# EAGLE design v3 (EAGLE 5.11)
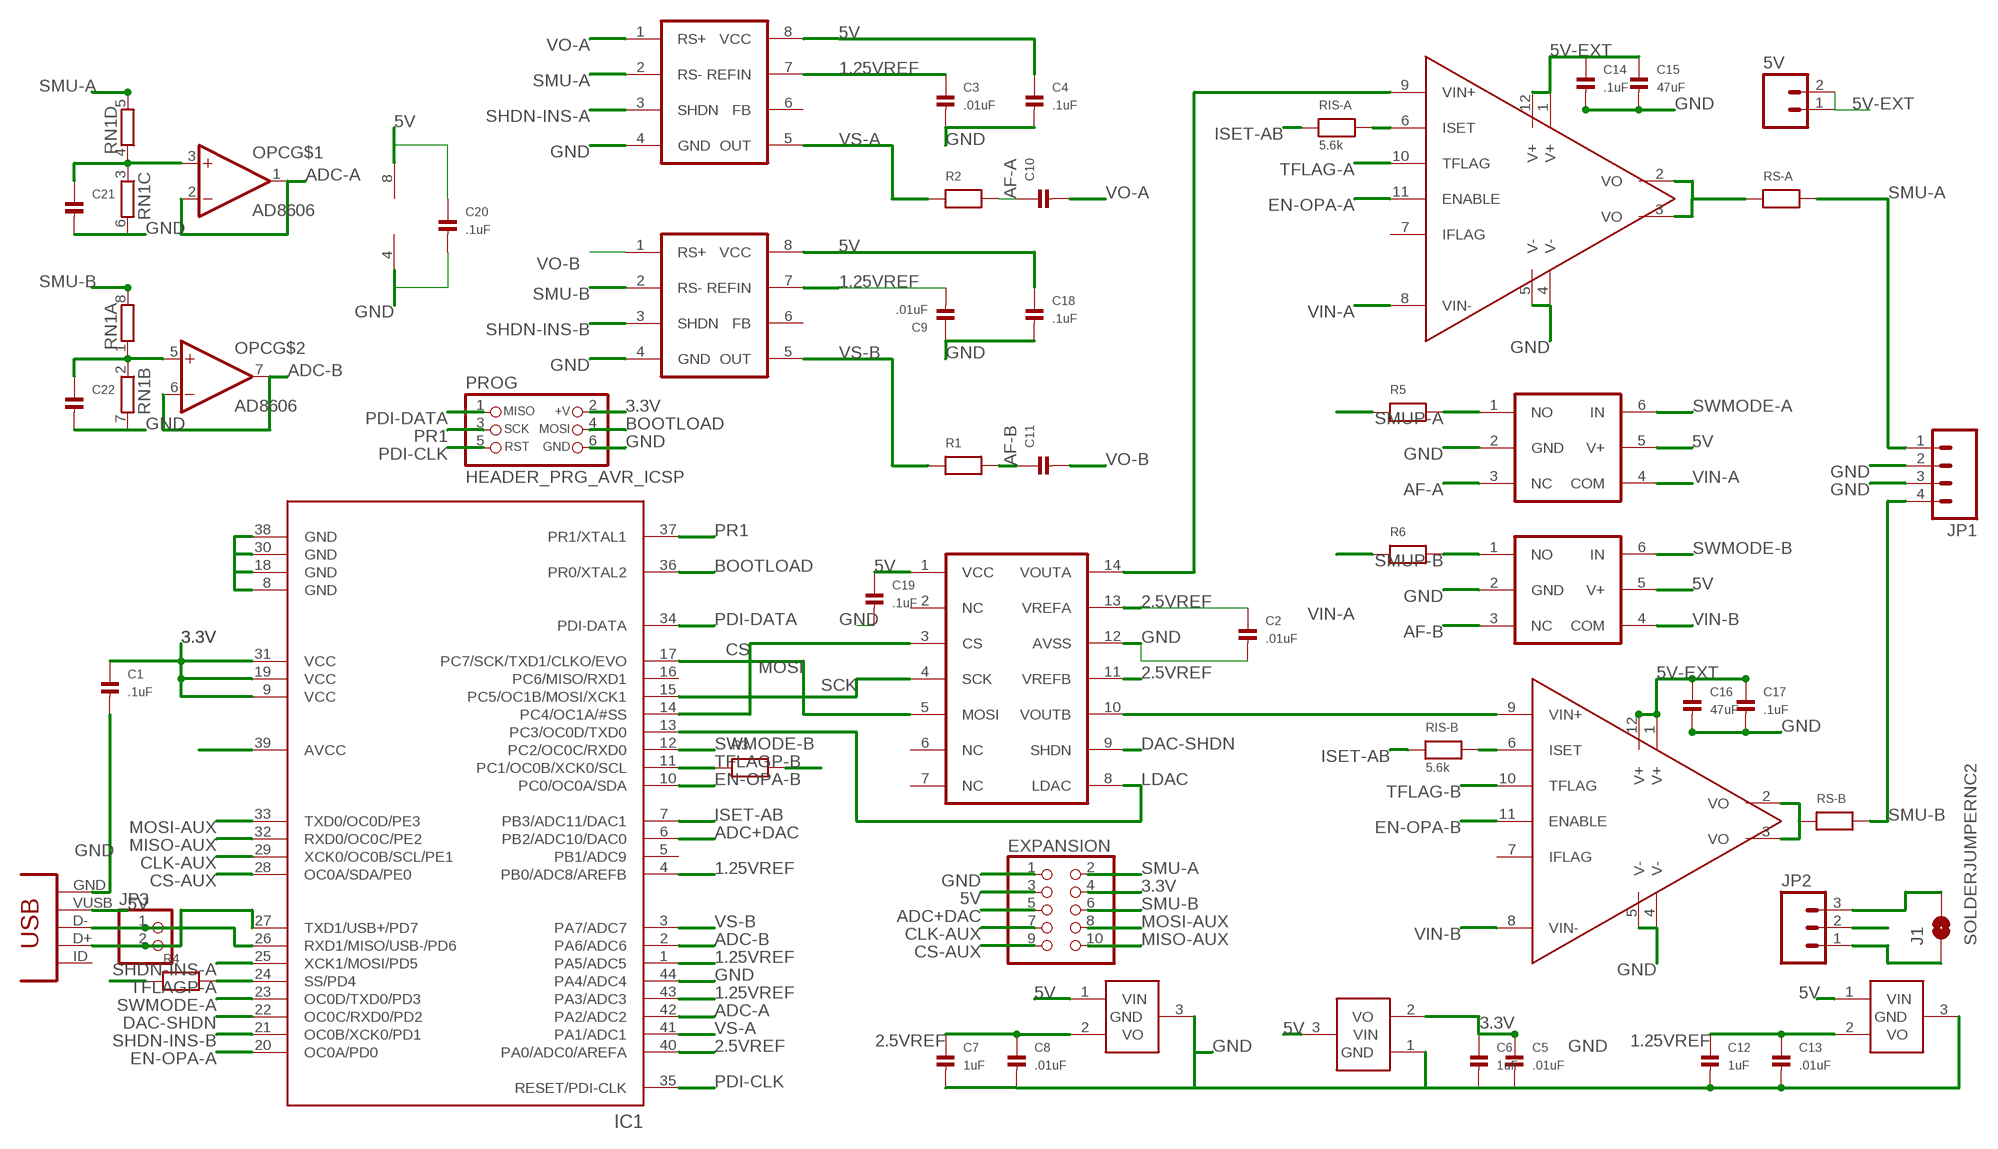
[diagram p0: schematic, sheet 1]

## Parts
1.25REF  VREFVREF  [SOT23-3]
2.5REF  VREFVREF  [SOT23-3]
3.3V  VREG  [SOT23-3]
5V  M02PTH  [1X02]
C1  .1uF  CAP_CERAMIC0603  [0603]
C2  .01uF  CAP_CERAMIC0603  [0603]
C3  .01uF  CAP_CERAMIC0603  [0603]
C4  .1uF  CAP_CERAMIC0603  [0603]
C5  .01uF  CAP_CERAMIC0603  [0603]
C6  1uF  CAP_CERAMIC0603  [0603]
C7  1uF  CAP_CERAMIC0603  [0603]
C8  .01uF  CAP_CERAMIC0603  [0603]
C9  .01uF  CAP_CERAMIC0603  [0603]
C10  CAP_CERAMIC0603  [0603]
C11  CAP_CERAMIC0603  [0603]
C12  1uF  CAP_CERAMIC0603  [0603]
C13  .01uF  CAP_CERAMIC0603  [0603]
C14  .1uF  CAP_CERAMIC0603  [0603]
C15  47uF  CAP_CERAMIC1206  [1206]
C16  47uF  CAP_CERAMIC1206  [1206]
C17  .1uF  CAP_CERAMIC0603  [0603]
C18  .1uF  CAP_CERAMIC0603  [0603]
C19  .1uF  CAP_CERAMIC0603  [0603]
C20  .1uF  CAP_CERAMIC0603  [0603]
C21  CAP_CERAMIC0603  [0603]
C22  CAP_CERAMIC0603  [0603]
CS-A  MAX9919  [SO-08]
CS-B  MAX9919  [SO-08]
DAC  MCP4922  MCP4922SOIC  [SO-14]
EXPANSION  HEADER-2X5  [2X05]
IC1  ATXMEGAXXA4U  [TQFP-44]
J1  SOLDERJUMPERNC2  [SJ_2S-NOTRACE]
JP1  M04PTH  [1X04]
JP2  M03PTH  [1X03]
JP3  HEADER-1X2ROUND  [1X02_ROUND]
OPA-A  OPA567  [QFN-12]
OPA-B  OPA567  [QFN-12]
OPC  AD8606  [SO-08]
PROG  HEADER_PRG_AVR_ICSP  [HEADER_PRG_2X03]
R1  RESISTOR0603  [0603]
R2  RESISTOR0603  [0603]
R3  RESISTOR0603  [0603]
R4  RESISTOR0603  [0603]
R5  RESISTOR0603  [0603]
R6  RESISTOR0603  [0603]
RIS-A  5.6k  RESISTOR0603  [0603]
RIS-B  5.6k  RESISTOR0603  [0603]
RN1  RNETWORK  [RN8P-4R-CRA06S]
RS-A  RESISTOR1206  [1206]
RS-B  RESISTOR1206  [1206]
SWA  TS5A3157  [SOT23-6]
SWB  TS5A3157  [SOT23-6]
USB1  USB-MINI-BUSB1  [CONN_USB_MINI-B]

## Nets
1.25VREF: 1.25REF.2(VO) C3.1 C9.2 C12.1 C13.1 CS-A.7(REFIN) CS-B.7(REFIN) IC1.1(PA5/ADC5) IC1.4(PB0/ADC8/AREFB) IC1.43(PA3/ADC3)
2.5VREF: 2.5REF.2(VO) C2.1 C7.1 C8.1 DAC.11(VREFB) DAC.13(VREFA) IC1.40(PA0/ADC0/AREFA)
3.3V: 3.3V.2(VO) C1.1 C5.1 C6.1 EXPANSION.4 IC1.9(VCC) IC1.19(VCC) IC1.31(VCC) IC1.39(AVCC) PROG.2(+V)
5V: 1.25REF.1(VIN) 2.5REF.1(VIN) 3.3V.3(VIN) C4.1 C18.1 C19.1 C20.1 CS-A.8(VCC) CS-B.8(VCC) DAC.1(VCC) EXPANSION.3 J1.1 JP2.1 OPC.8(V+) SWA.5(V+) SWB.5(V+) USB1.VUSB
5V-EXT: 5V.1 5V.2 C14.1 C15.1 C16.1 C17.1 J1.2 JP2.3 OPA-A.1(V+) OPA-A.12(V+) OPA-B.1(V+) OPA-B.12(V+)
ADC+DAC: EXPANSION.5 IC1.6(PB2/ADC10/DAC0)
ADC-A: IC1.42(PA2/ADC2) OPC.1(OUT) OPC.2(-IN)
ADC-B: IC1.2(PA6/ADC6) OPC.6(-IN) OPC.7(OUT)
AF-A: C10.1 R2.2 SWA.3(NC)
AF-B: C11.1 R1.2 SWB.3(NC)
BOOTLOAD: IC1.36(PR0/XTAL2) PROG.4(MOSI)
CLK-AUX: EXPANSION.7 IC1.29(XCK0/OC0B/SCL/PE1)
CS: DAC.3(CS) IC1.14(PC4/OC1A/#SS)
CS-AUX: EXPANSION.9 IC1.28(OC0A/SDA/PE0)
D+: IC1.27(TXD1/USB+/PD7) JP3.2 USB1.D+
D-: IC1.26(RXD1/MISO/USB-/PD6) JP3.1 USB1.D-
DAC-SHDN: DAC.9(SHDN) IC1.22(OC0C/RXD0/PD2)
EN-OPA-A: IC1.20(OC0A/PD0) OPA-A.11(ENABLE)
EN-OPA-B: IC1.10(PC0/OC0A/SDA) OPA-B.11(ENABLE)
GND: 1.25REF.3(GND) 2.5REF.3(GND) 3.3V.1(GND) C1.2 C2.2 C3.2 C4.2 C5.2 C6.2 C7.2 C8.2 C9.1 C12.2 C13.2 C14.2 C15.2 C16.2 C17.2 C18.2 C19.2 C20.2 C21.2 C22.2 CS-A.4(GND) CS-B.4(GND) DAC.12(AVSS) EXPANSION.1 IC1.8(GND) IC1.18(GND) IC1.30(GND) IC1.38(GND) IC1.44(PA4/ADC4) JP1.2 JP1.3 JP2.2 OPA-A.4(V-) OPA-A.5(V-) OPA-B.4(V-) OPA-B.5(V-) OPC.4(V-) PROG.6(GND) RN1.6 RN1.7 SWA.2(GND) SWB.2(GND) USB1.GND
IC2A-: C21.1 OPC.3(+IN) RN1.3 RN1.4
IC2B-: C22.1 OPC.5(+IN) RN1.1 RN1.2
ISET-A: OPA-A.6(ISET) RIS-A.2
ISET-AB: IC1.7(PB3/ADC11/DAC1) RIS-A.1 RIS-B.1
ISET-B: OPA-B.6(ISET) RIS-B.2
LDAC: DAC.8(LDAC) IC1.13(PC3/OC0D/TXD0)
MISO-AUX: EXPANSION.10 IC1.32(RXD0/OC0C/PE2)
MOSI: DAC.5(MOSI) IC1.17(PC7/SCK/TXD1/CLKO/EVO)
MOSI-AUX: EXPANSION.8 IC1.33(TXD0/OC0D/PE3)
PDI-CLK: IC1.35(RESET/PDI-CLK) PROG.5(RST)
PDI-DATA: IC1.34(PDI-DATA) PROG.1(MISO)
PR1: IC1.37(PR1/XTAL1) PROG.3(SCK)
SCK: DAC.4(SCK) IC1.15(PC5/OC1B/MOSI/XCK1)
SHDN-INS-A: CS-A.3(SHDN) IC1.25(XCK1/MOSI/PD5)
SHDN-INS-B: CS-B.3(SHDN) IC1.21(OC0B/XCK0/PD1)
SMU-A: CS-A.2(RS-) EXPANSION.2 JP1.1 R5.1 RN1.5 RS-A.2
SMU-B: CS-B.2(RS-) EXPANSION.6 JP1.4 R6.1 RN1.8 RS-B.2
SMUP-A: R5.2 SWA.1(NO)
SMUP-B: R6.2 SWB.1(NO)
SWMODE-A: IC1.23(OC0D/TXD0/PD3) SWA.6(IN)
SWMODE-B: IC1.12(PC2/OC0C/RXD0) SWB.6(IN)
TFLAG-A: OPA-A.10(TFLAG) R4.1
TFLAG-B: OPA-B.10(TFLAG) R3.2
TFLAGP-A: IC1.24(SS/PD4) R4.2
TFLAGP-B: IC1.11(PC1/OC0B/XCK0/SCL) R3.1
VIN-A: OPA-A.8(VIN-) SWA.4(COM)
VIN-B: OPA-B.8(VIN-) SWB.4(COM)
VO-A: C10.2 CS-A.1(RS+) OPA-A.2(VO) OPA-A.3(VO) RS-A.1
VO-B: C11.2 CS-B.1(RS+) OPA-B.2(VO) OPA-B.3(VO) RS-B.1
VOUT-A: DAC.14(VOUTA) OPA-A.9(VIN+)
VOUT-B: DAC.10(VOUTB) OPA-B.9(VIN+)
VS-A: CS-A.5(OUT) IC1.41(PA1/ADC1) R2.1
VS-B: CS-B.5(OUT) IC1.3(PA7/ADC7) R1.1
Unconnected: CS-A.6(FB) CS-B.6(FB) DAC.2(NC) DAC.6(NC) DAC.7(NC) IC1.5(PB1/ADC9) IC1.16(PC6/MISO/RXD1) OPA-A.7(IFLAG) OPA-B.7(IFLAG) USB1.BODY@1(BODY) USB1.BODY@2(BODY) USB1.BODY@3(BODY) USB1.BODY@4(BODY) USB1.ID(USBID)

## Library data of the parts
1.25REF 2.5REF = nonolith:VREF
3.3V = nonolith:VREG
5V = SparkFun:M02: Header 2 Standard 2-pin 0.1" header. Use with straight break away headers (SKU : PRT-00116), right angle break away headers (PRT-00553), swiss pins (PRT-00743), machine pins (PRT-00117), and female headers (PRT-00115). Molex polarized connector foot print use with SKU : PRT-08233 with associated crimp pins and housings.
C1-C22 = nonolith:CAP_CERAMIC: Ceramic Capacitors 0402 - 0402 Surface Mount Capacitors 0.1uF 10V 10% [Digikey: 490-1318-2-ND] 0603 - 0603 Surface Mount Capacitors 16 pF 50V 5% [Digikey: 445-5051-2-ND] 22 pF 50V [Digikey: PCC220ACVTR-ND] 33 pF 50V 5% [Digikey: 490-1415-1-ND] 56pF 50V 5% [Digikey: 490-1421-1-ND] 220pF 50V 5% [Digikey: 445-1285-1-ND] 680 pF 50V 2200 pF 50V 5% C0G [Digikey: 445-1297-1-ND] 5600 pF 100V 5% X7R [Digikey: 478-3711-1-ND] 0.1 µF 25V 10% [Digikey: PCC2277TR-ND] 0.22 µF 16V 10% X7R [Digikey: 445-1318-1-ND] 1.0 µF 25V 10% [Digikey: 445-5146-2-ND] 0603 - RF Specific 3pF 250V +/-0.1pF RF [Digikey: 712-1347-1-ND] 18 pF 250V 5% [Digikey: 478-3505-1-ND or 712-1322-1-ND] 56 pF 250V 5% C0G RF [Digikey: 490-4867-1-ND] 68 pF 250V RF [Digikey: 490-4868-1-ND] 0805 - 0805 Surface Mount Capacitors 220 pF 250V 2% RF Ceramic Capacitor [Digikey: 712-1398-1-ND] 1000 pF 50V 2% NP0 Ceramic Capacitor [Digikey: 478-3760-1-ND] 0.1 µF 25V 10% Ceramic Capacitor [Digikey: PCC1828TR-ND] 1.0 µF 16V 10% Ceramic Capacitor[Digikey: 490-1691-2-ND] 10.0 µF 10V 10% Ceramic Capacitor[Digikey: 709-1228-1-ND] 1206 - 1206 Surface Mount Capacitors
CS-A CS-B = nonolith:MAX9919: MAX9919 single-channel current sense amp with high common mode voltage range and high bandwidth
DAC = nonolith:MCP4922: MCP4922 12b SPI DAC
EXPANSION = nonolith:HEADER-2X5: PIN HEADER
IC1 = nonolith:ATXMEGAXXA4U: ATXMEGA A4U Series (XMEGA+USB)
J1 = SparkFun:SOLDERJUMPER: Solder Jumper Standard SMD solder jumper. Used to automate production. Two varients : Normally Open and Normally Closed are the same, but have different paste layers. NC will have a large amount of paste and should jumper during reflow.
JP1 = SparkFun:M04: Header 4 Standard 4-pin 0.1" header. Use with straight break away headers (SKU : PRT-00116), right angle break away headers (PRT-00553), swiss pins (PRT-00743), machine pins (PRT-00117), and female headers (PRT-00115). Molex polarized connector foot print use with SKU : PRT-08231 with associated crimp pins and housings. 1MM SMD Version SKU: PRT-10208
JP2 = SparkFun:M03: Header 3 Standard 3-pin 0.1" header. Use with straight break away headers (SKU : PRT-00116), right angle break away headers (PRT-00553), swiss pins (PRT-00743), machine pins (PRT-00117), and female headers (PRT-00115). Molex polarized connector foot print use with SKU : PRT-08232 with associated crimp pins and housings.
JP3 = nonolith:HEADER-1X2: PIN HEADER
OPA-A OPA-B = nonolith:OPA567: OPA567: 2a RRIO CMOS OPA / QFN12
OPC = nonolith:AD8606
PROG = dp_devices:HEADER_PRG_AVR_ICSP: 2x3 AVR ICSP programming header
R1-R6 RIS-A RIS-B RS-A RS-B = nonolith:RESISTOR: Resistors 0402 - 0402 Surface Mount Package 10.0K 1% 1/16W [Digikey: 311-10.0KLRTR-ND] 0603 - 0603 Surface Mount Package 0 Ohm 1/10 Watt 1% Resistor 15 Ohm 1/10 Watt 1% Resistor 33 Ohm 1/10 Watt 1% Resistor 49.9 Ohm 1/10 Watt 1% Resistor 100 Ohm 1/10 Watt 1% Resistor 150 Ohm 1/10 Watt 1% Resistor 240 Ohm 1/10 Watt 1% Resistor 390 Ohm 1/10 Watt 1% Resistor 560 Ohm 1/10 Watt 1% Resistor 750 Ohm 1/10 Watt 1% Resistor 1.0K Ohm 1/10 Watt 1% Resistor 1.5K Ohm 1/10 Watt 1% Resistor 2.0K Ohm 1/10 Watt 1% Resistor 4.7K Ohm 1/10 Watt 1% Resistor 10.0K Ohm 1/10 Watt 1% Resistor 20.0K Ohm 1/10 Watt 1% Resistor 33.0K Ohm 1/10 Watt 1% Resistor 100.0K Ohm 1/10 Watt 1% Resistor 0805 - 0805 Surface Mount Package 0 Ohm 1/8 Watt 1% Resistor 33 Ohm 1/8 Watt 1% Resistor 100 Ohm 1/8 Watt 1% Resistor 150 Ohm 1/8 Watt 1% Resistor 200 Ohm 1/8 Watt 1% Resistor 240 Ohm 1/8 Watt 1% Resistor 330 Ohm 1/8 Watt 1% Resistor 390 Ohm 1/8 Watt 1% Resistor 470 Ohm 1/8 Watt 1% Resistor 1.0K Ohm 1/8 Watt 1% Resistor 1.5K Ohm 1/8 Watt 1% Resistor 2.0K Ohm 1/8 Watt 1% Resistor 4.7K Ohm 1/8 Watt 1% Resistor 5.1K Ohm 1/8 Watt 1% Resistor 5.6K Ohm 1/8 Watt 1% Resistor 10.0K Ohm 1/8 Watt 1% Resistor 22.0K Ohm 1/8 Watt 1% Resistor 33.0K Ohm 1/8 Watt 1% Resistor 100K Ohm 1/8 Watt 1% Resistor 1206 - 1206 Surface Mount Package
RN1 = nonolith:RNETWORK: 4 Resistor Array 0603
SWA SWB = nonolith:TS5A3157: Single SPDT Switch in SOT23
USB1 = nonolith:USB-MINI-B: USB connector

## Net classes
0 default: width 0.254 mm, clearance 0.127 mm

## Board
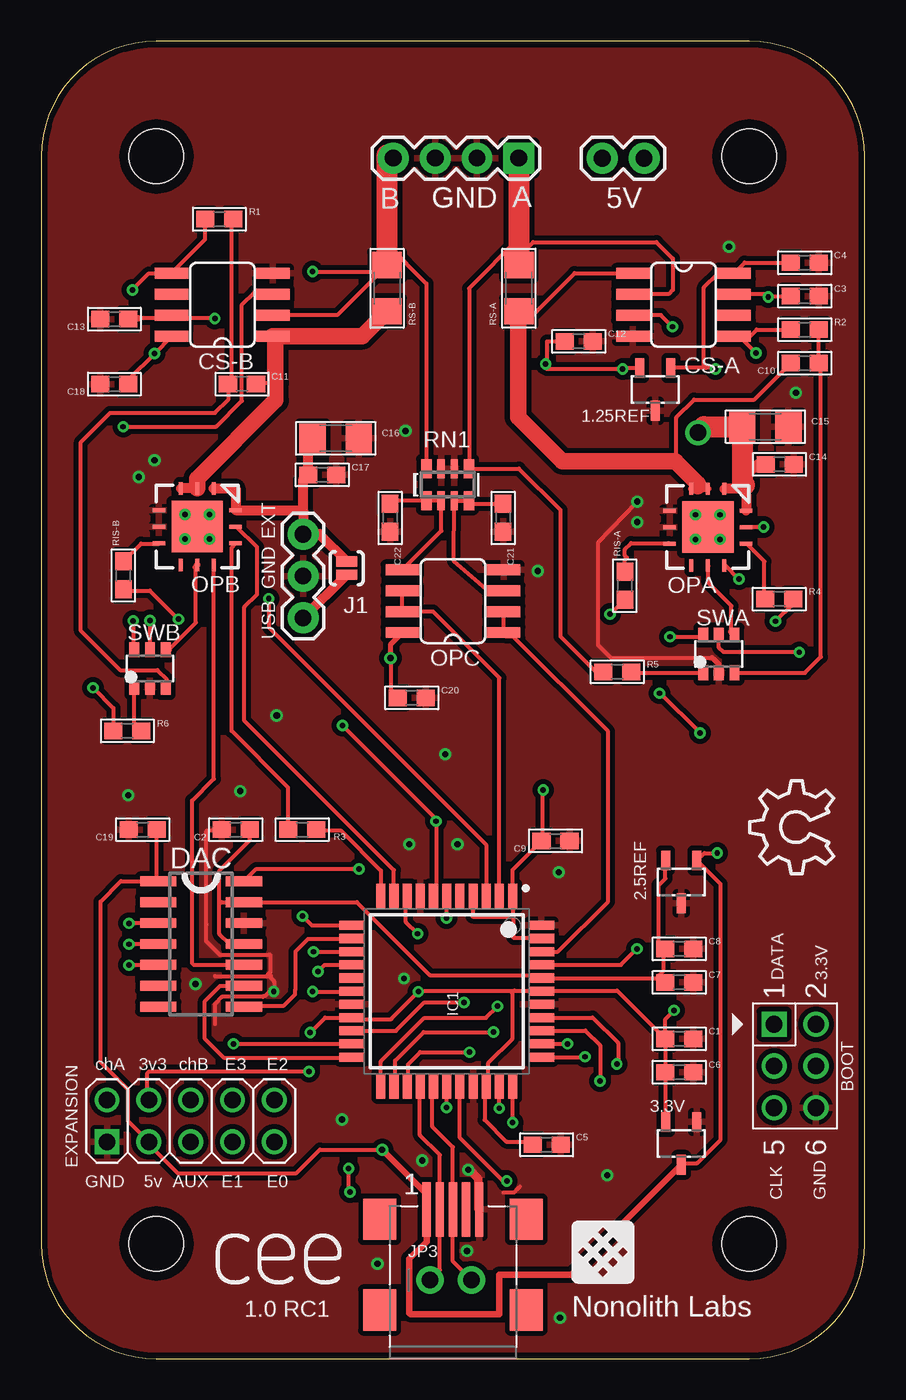
[diagram p1: board, top side]
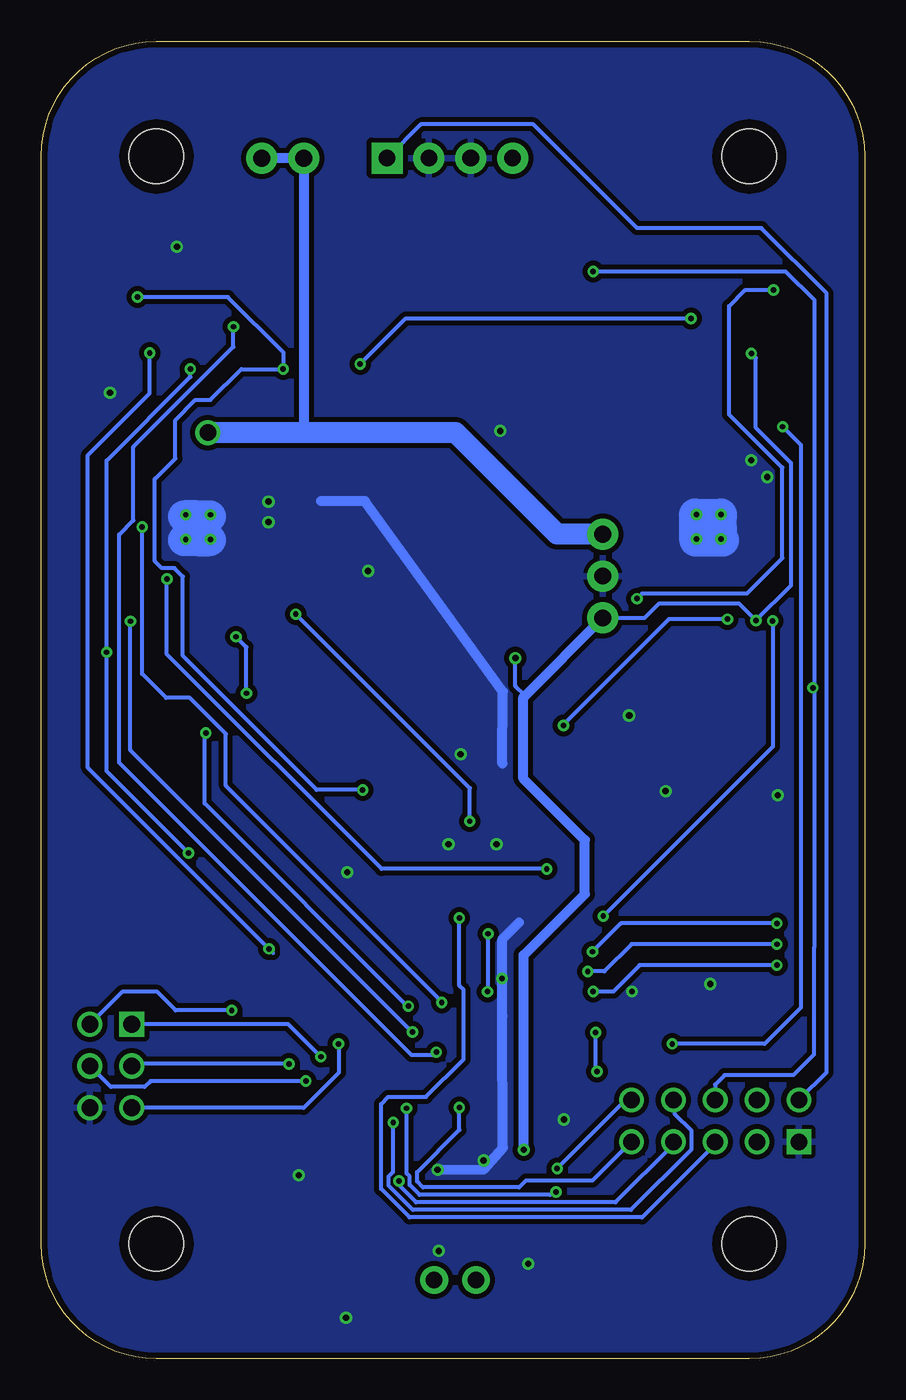
[diagram p2: board, bottom side, seen from below]

Size 50 x 80 mm. Coordinates in mm from the lower left corner, seen from the top.
Outline: 43,0 arc90 50,7 50,73 arc90 43,80 7,80 arc90 0,73 0,7 arc90 7,0 43,0
Copper layers (1*16): Top 0.0356mm / dielectric 1.5011mm / Bottom 0.0356mm
Design rules "LaenPCBOrder *": minimum track width 6mil, minimum drill 13mil, track to track 6mil, track to pad 6mil, pad to pad 6mil, via to via 6mil, smd to smd 6mil, copper to edge 15mil, drill to drill 6mil, minimum pad ring 7mil, minimum via ring 7mil, stop-mask expansion 4mil, vias tented up to drill 0mil, thermal gap 10mil

### Footprints (pad centres in the part's own frame; a part is rotated, then mirrored left to right if it is on the bottom)
SOT23-3 = smd 0.55 x 1.2: 1 0.95,1.3; 2 -0.95,1.3; 3 0,-1.3
1X02 = drill 1.016 pad 1.88 round: 1 0,0; 2 2.54,0
0603 = smd 1.1 x 1: 1 -0.85,0; 2 0.85,0
1206 = smd 1.6 x 1.8: 1 -1.4,0; 2 1.4,0
SO-08 = smd 0.66 x 2.032: 1 -1.905,-3.073; 2 -0.635,-3.073; 3 0.635,-3.073; 4 1.905,-3.073; 5 1.905,3.073; 6 0.635,3.073; 7 -0.635,3.073; 8 -1.905,3.073
SO-14 = smd 0.6 x 2.2: 1 -3.81,-2.6; 2 -2.54,-2.6; 3 -1.27,-2.6; 4 0,-2.6; 5 1.27,-2.6; 6 2.54,-2.6; 7 3.81,-2.6; 8 3.81,2.6; 9 2.54,2.6; 10 1.27,2.6; 11 0,2.6; 12 -1.27,2.6; 13 -2.54,2.6; 14 -3.81,2.6
2X05 = drill 1 square: 1 -5.08,-1.27 | drill 1 round: 2 -5.08,1.27; 3 -2.54,-1.27; 4 -2.54,1.27; 5 0,-1.27; 6 0,1.27; 7 2.54,-1.27; 8 2.54,1.27; 9 5.08,-1.27; 10 5.08,1.27
TQFP-44 = smd 1.55 x 0.55: 1 -5.75,4; 2 -5.75,3.2; 3 -5.75,2.4; 4 -5.75,1.6; 5 -5.75,0.8; 6 -5.75,0; 7 -5.75,-0.8; 8 -5.75,-1.6; 9 -5.75,-2.4; 10 -5.75,-3.2; 11 -5.75,-4; 23 5.75,-4; 24 5.75,-3.2; 25 5.75,-2.4; 26 5.75,-1.6; 27 5.75,-0.8; 28 5.75,0; 29 5.75,0.8; 30 5.75,1.6; 31 5.75,2.4; 32 5.75,3.2; 33 5.75,4 | smd 0.55 x 1.55: 12 -4,-5.75; 13 -3.2,-5.75; 14 -2.4,-5.75; 15 -1.6,-5.75; 16 -0.8,-5.75; 17 0,-5.75; 18 0.8,-5.75; 19 1.6,-5.75; 20 2.4,-5.75; 21 3.2,-5.75; 22 4,-5.75; 34 4,5.75; 35 3.2,5.75; 36 2.4,5.75; 37 1.6,5.75; 38 0.8,5.75; 39 0,5.75; 40 -0.8,5.75; 41 -1.6,5.75; 42 -2.4,5.75; 43 -3.2,5.75; 44 -4,5.75
SJ_2S-NOTRACE = smd 0.635 x 1.27: 1 -0.401,0; 2 0.413,0
1X04 = drill 1.016 pad 1.88 square: 1 0,0 | drill 1.016 pad 1.88 round: 2 2.54,0; 3 5.08,0; 4 7.62,0
1X03 = drill 1.016 pad 1.88 round: 1 0,0; 2 2.54,0; 3 5.08,0
1X02_ROUND = drill 1 pad 1.676 round: 1 -1.27,0; 2 1.27,0
QFN-12 = smd 0.75 x 0.24: 1 -2.365,0.96; 2 -2.365,-0.04; 3 -2.365,-1.04; 7 2.285,-1.04; 8 2.285,-0.04; 9 2.285,0.96 | smd 0.24 x 0.75: 4 -1.04,-2.365; 5 -0.04,-2.365; 6 0.96,-2.365; 10 0.96,2.285; 11 -0.04,2.285; 12 -1.04,2.285 | smd 3.12 x 3.12: P$1 -0.04,-0.04 | drill 0.33 round: P$2 -0.786,0.706; P$4 0.706,0.706; P$6 -0.786,-0.786; P$7 0.706,-0.786
HEADER_PRG_2X03 = drill 1.016 square: 1 -2.54,-1.27 | drill 1.016 round: 2 -2.54,1.27; 3 0,-1.27; 4 0,1.27; 5 2.54,-1.27; 6 2.54,1.27
RN8P-4R-CRA06S = smd 0.63 x 1.15: 1 -1.295,-0.975; 4 1.295,-0.975; 5 1.295,0.975; 8 -1.295,0.975 | smd 0.44 x 1.15: 2 -0.4,-0.975; 3 0.4,-0.975; 6 0.4,0.975; 7 -0.4,0.975
SOT23-6 = smd 0.6 x 0.9: 1 -0.95,-1.15; 2 0,-1.15; 3 0.95,-1.15; 4 0.95,1.15; 5 0,1.15; 6 -0.95,1.15
STAND-OFF = hole 3.302: 0,0
CONN_USB_MINI-B = smd 2 x 2.5: BODY@1 -4.45,2.5; BODY@2 4.45,2.5; BODY@3 4.45,-3; BODY@4 -4.45,-3 | smd 0.5 x 3.3: D+ 0,3.1; D- -0.8,3.1; GND 1.6,3.1; ID 0.8,3.1; VUSB -1.6,3.1

### Placement (x,y rotation side)
1.25REF  37.28,58.86 0 top
2.5REF  38.86,28.96 0 top
3.3V  38.86,13.08 0 top
5V  34.06,72.9 0 top
C1  38.73,19.43 0 top
C2  11.81,32.13 180 top
C3  46.35,64.52 0 top
C4  46.35,66.55 0 top
C5  30.69,13 0 top
C6  38.73,17.4 0 top
C7  38.73,22.86 0 top
C8  38.73,24.89 0 top
C9  31.23,31.44 180 top
C10  46.35,60.45 180 top
C11  12.19,59.18 0 top
C12  32.63,61.78 0 top
C13  4.45,63.12 180 top
C14  44.83,54.31 0 top
C15  43.97,56.59 0 top
C16  17.88,55.88 0 top
C17  17.07,53.67 0 top
C18  4.45,59.18 180 top
C19  6.17,32.13 180 top
C20  22.5,40.13 0 top
C21  28.04,51.05 270 top
C22  21.18,51.05 270 top
CS-A  39,64 270 top
CS-B  11,64 90 top
DAC  9.71,25.19 270 top
EXPANSION  9.08,14.45 0 top
IC1  24.62,22.32 270 top
J1  18.54,48.01 90 top
JP1  29,72.9 180 top
JP2  15.9,44.98 90 top
JP3  24.87,4.78 0 top
OPA-A  40.51,50.46 270 top
OPA-B  9.51,50.49 270 top
OPC  25,46 90 top
PROG  45.77,17.78 270 top
R1  10.82,69.19 0 top
R2  46.35,62.48 0 top
R3  15.85,32.13 180 top
R4  44.81,46.13 0 top
R5  34.98,41.71 0 top
R6  5.23,38.13 0 top
RIS-A  35.43,46.93 90 top
RIS-B  5,47.57 90 top
RN1  24.68,53.08 0 top
RS-A  29,65 90 top
RS-B  21,65 90 top
SWA  41.15,42.8 0 top
SWB  6.6,41.91 0 top
U$1  [OSHW_8X200_NOTEXT]  48.11,29.44 90 top
U$2  [LOGO_CEE]  10.49,4.11 0 top
U$3  [LOGO_NONOLITH]  32.21,4.57 0 top
U$8  [STAND-OFF]  7,7 0 top
U$9  [STAND-OFF]  43,7 0 top
U$10  [STAND-OFF]  43,73 0 top
U$11  [STAND-OFF]  7,73 0 top
USB1  25,5.97 0 top

### Tracks (layer width: path | path; a pad name or v marks a point on that pad's centre or on a via)
1.25VREF  (via drill 0.33)
  Top 0.254: CS-A.7 43.98,64.64 v44.15,64.47 44.19,64.52 C3.1 | C9.2 | 28.65,26.85 28.65,28.07 IC1.1 28.62,29.68 C9.2 | 26.22,26.85 28.65,26.85 | 26.22,26.85 26.19,26.85 | 26.22,26.85 IC1.4 | 28.65,26.85 28.65,25.6 28.7,25.55 30.34,25.55 | C9.2 30.45,31.52 30.45,34.52 v30.48,34.54 | 30.72,60.48 v30.63,60.4 | 7.73,63.17 CS-B.7 | v10.54,63.17 7.73,63.17 | 7.73,63.17 5.89,63.17 | 30.72,60.48 30.72,60.1 v35.31,60.1 35.37,60.16 1.25REF.2 | 30.72,60.48 30.72,61.78 C12.1
  Top 0.406: 30.34,25.55 30.37,25.55 IC1.43 | 5.89,63.17 C13.1
  Bottom 0.254: v44.15,64.47 38.66,64.47 35.28,61.09 35.28,60.12 v35.31,60.1 37.85,60.1 39.73,58.22 40.64,58.22 41.86,57 41.86,54.66 43.08,53.44 43.1,53.44 43.1,48.44 42.67,48.01 41.91,48.01 41.4,47.5 41.4,42.67 33.27,34.54 v30.48,34.54 | v10.54,63.17 27.86,63.17 v30.63,60.4
2.5VREF
  Top 0.254: DAC.13 19.16,27.73 23.6,23.29 30.25,23.29 30.28,23.27 IC1.40 37.37,23.12 37.49,23.16 37.8,22.86 C7.1 37.49,23.27 37.8,23.57 37.8,24.89 C8.1 37.8,24.99 37.49,25.3 37.49,28.75 37.9,29.16 37.9,30.18 2.5REF.2 | DAC.13 12.27,27.69 | DAC.13 12.25,27.66 | DAC.11 11.41,25.19 10.82,25.78 10.82,27.61 | DAC.13 10.94,27.73 10.82,27.61 | 10.82,27.61 10.82,29.64 12.68,31.5 12.68,32.12 C2.1
3.3V  (via drill 0.33)
  Top 0.254: v22.86,25.81 22.15,26.52 22.15,27.94 IC1.9 | IC1.39 30.18,22.35 28.73,22.35 | 28.73,22.35 22.96,22.35 v22.9,22.29 21.26,20.65 21.26,20.62 18.9,20.62 18.9,20.69 IC1.19 17.24,20.72 v16.33,19.81 | C5.1 29.65,13.18 28.25,13.18 26.92,14.5 26.92,16.47 IC1.31 27.11,16.66 27.13,16.66 27.13,17.93 28.6,19.41 28.6,22.23 28.73,22.35 | EXPANSION.4 6.45,15.8 6.45,17.35 6.55,17.45 v16.26,17.45 | C1.1 37.87,18.99 | C1.1 37.89,19.44 37.89,20.62 v38.43,21.16 | 3.3V.2 37.9,14.43 37.9,17.37 C6.1 C1.1 | 30.4,22.35 34.96,22.35 C1.1
  Top 0.406: IC1.39 30.4,22.35
  Bottom 0.254: v22.86,25.81 22.86,22.23 v22.9,22.29 | v16.26,17.45 16.33,17.53 v16.33,19.81 | v38.43,21.16 41.83,21.16 42.95,22.28 45.09,22.28 PROG.2
5V  (via drill 0.33, 0.38)
  Top 0.254: v6.6,44.83 SWB.5 | SWA.5 41.15,43.18 41.43,42.9 45.97,42.9 46,42.93 | JP2.1 15.92,44.98 | C4.1 42.72,66.55 CS-A.8 42.04,65.91 41.1,65.91 40.23,65.05 40.23,60.28 40.36,60.16 | 2.5REF.1 39.83,30.18 | 38.81,11.68 3.3V.3 38.91,11.89 39.83,11.89 41.25,13.31 41.25,28.82 2.5REF.1 | 40.36,60.16 40.88,60.16 v40.95,60.1 | 40.36,60.16 1.25REF.1 | v41.05,30.71 40.27,30.71 2.5REF.1 | 46,42.93 46.02,42.95 | v46.02,42.9 46,42.93 | C18.1 5.29,59.46 5.31,59.46 v6.88,61.04 CS-B.8 | 23.44,10.21 23.44,9.11 USB1.VUSB | v20.7,12.7 16.92,12.7 15.49,11.28 8.28,11.28 6.55,13.01 6.55,13.16 EXPANSION.3 5.28,14.43 5.28,16.33 3.61,18.01 3.61,27.76 4.84,29 DAC.1 7.02,29 C19.1 | C20.1 21.21,40.13 v21.21,42.55
  Top 0.305: v21.21,42.55 21.21,43.38 OPC.8
  Top 0.406: 23.44,10.21 23.19,10.21 v20.7,12.7 | USB1.VUSB 23.4,7.12 22.35,6.07 22.35,2.77 22.43,2.69 27.81,2.69 27.81,5.11 32.19,5.11 3.3V.3
  Top 0.61: 15.92,44.98 J1.1
  Bottom 0.254: JP2.1 13.36,44.98 12.47,45.87 7.64,45.87 v6.6,44.83 4.47,46.97 4.47,54.38 6.6,56.52 6.6,60.76 v6.88,61.04 | 20.7,40.18 20.62,40.26 21.21,40.84 v21.21,42.55 | v40.95,60.1 40.95,59.61 46.02,54.53 v46.02,42.9 46.02,35.69 v41.05,30.71
  Bottom 0.61: 20.62,40.26 JP2.1 | v20.7,12.7 20.7,24.51 16.99,28.22 16.99,31.5 20.73,35.23 20.73,40.16 20.7,40.18
5V-EXT  (via drill 1.02)
  Top 0.61: 16.4,55.35 C16.1 16.22,55.72 C17.1 15.9,53.35 15.9,51.52 | OPA-A.12 42.8,52.45 42.45,52.83 | 42.45,52.83 OPA-A.1 | J1.2 16.9,50.06 JP2.3 15.9,51.52 | 42.45,52.83 42.69,53.07 42.77,53.15 | OPA-B.1 11.8,52.85 OPA-B.12 15.9,51.52 | C14.1 43.48,54.3 42.57,53.39
  Top 1.27: v39.88,56.24 40.23,56.59 C15.1 42.57,53.39 42.57,53.19 42.69,53.07
  Bottom 0.254: 34.04,72.87 5V.1
  Bottom 0.61: 5V.1 5V.2 | 34.04,56.24 34.04,72.87
  Bottom 1.27: v39.88,56.24 34.04,56.24 24.84,56.24 18.67,50.06 JP2.3
ADC+DAC  (via drill 0.33)
  Top 0.254: v24.61,26.77 IC1.6
  Bottom 0.254: v24.61,26.77 24.61,22.66 24.36,22.4 24.36,18.19 26.64,15.9 28.93,15.9 29.36,15.47 29.36,10.31 27.64,8.59 13.51,8.59 9.09,13.01 9.09,13.16 EXPANSION.5
ADC-A
  Top 0.254: IC1.42 31.38,24.72 34.42,27.76 34.42,38.1 28.57,43.94 | OPC.1 OPC.2
  Top 0.406: 28.57,43.94 28.23,43.94 OPC.1
ADC-B
  Top 0.254: OPC.6 OPC.7 23.8,45.37 27.82,41.34 IC1.2
AF-A
  Top 0.254: C10.1 R2.2 | 42.16,41.55 SWA.3 46.37,41.65 47.35,42.62 47.35,60.31 C10.1 | C10.1 47.24,60.35
AF-B
  Top 0.254: SWB.3 7.62,40.74 7.62,41.25 7.06,41.81 4.8,41.81 2.41,44.2 2.41,55.65 4.19,57.43 10.54,57.43 11.38,58.27 11.38,59.13 C11.1 11.38,59.23 11.58,59.44 11.58,69.19 R1.2
BOOTLOAD  (via drill 0.33)
  Top 0.254: IC1.36 33.04,19.92 33.93,19.02 v33.93,16.87
  Bottom 0.254: PROG.4 45.77,16.51 43.71,16.51 43.36,16.87 36.17,16.87 36.09,16.87 v33.93,16.87
CLK-AUX  (via drill 0.33)
  Top 0.254: v28.27,10.79 28.25,10.85 27.99,10.85 25.43,13.41 IC1.29
  Bottom 0.254: v28.27,10.79 28.27,10.54 27.23,9.5 15.14,9.5 11.63,13.01 11.63,13.16 EXPANSION.7
CS  (via drill 0.33)
  Top 0.254: IC1.14 v16.54,24.71 | v5.33,26.44 7.1,26.44 DAC.3
  Bottom 0.254: v16.54,24.71 14.81,26.44 v5.33,26.44
CS-AUX  (via drill 0.33)
  Top 0.254: v24.61,15.27 IC1.28
  Bottom 0.254: v24.61,15.27 24.61,13.89 27.18,11.33 27.18,10.77 26.82,10.41 20.98,10.41 20.57,10.82 16.54,10.82 14.17,13.18 EXPANSION.9
D+
  Top 0.254: 23.75,16.5 23.75,14.1 25,12.85 USB1.D+ 25,5.91 JP3.2
  Top 0.406: 23.75,16.5 IC1.27
D-
  Top 0.254: 22.99,16.54 22.99,13.59 24.2,12.38 USB1.D- 24.2,5.38 JP3.1
  Top 0.406: 22.99,16.54 IC1.26
DAC-SHDN
  Top 0.254: IC1.22 18.84,18.29 11.07,18.29 9.93,19.43 9.93,21.72 10.86,22.65 DAC.9
EN-OPA-A  (via drill 0.33)
  Top 0.254: v43.87,50.49 42.83,50.49 OPA-A.11 | v25.68,21.64 23.27,21.64 21.54,19.91 19.14,19.91 19.14,19.92 IC1.20
  Bottom 0.254: 43.81,50.44 v43.87,50.49 43.87,41.58 42.42,40.13 40.97,40.13 38.79,37.95 38.79,34.8 25.68,21.69
  Bottom 0.406: v25.68,21.64 25.68,21.69
EN-OPA-B
  Top 0.254: OPA-B.11 11.89,50.49 13.11,49.28 13.11,46.41 12.34,45.65 12.34,38.73 21.41,29.67 IC1.10
GND  (via drill 0.33, 0.38, 0.41)
  Top 0.254: 40.74,42.57 34.59,42.57 33.83,43.33 33.83,49.58 v36.2,52.05 | 10.54,23.24 13.95,23.24 13.95,23.22 | 10.54,20.32 10.54,21.54 10.97,21.97 13.46,21.97 13.51,22.02 13.59,22.02 14.15,22.58 14.15,22.91 13.74,23.32 13.92,23.5 13.92,24.49 13.87,24.54 10.85,24.54 10.03,25.35 10.03,26.36 10.01,26.39 10.01,32.03 10.07,32.09 C2.2 | 28.07,10.08 28.7,10.08 29.08,10.46
  Top 0.305: SWA.2 41.15,42.16 40.74,42.57
  Top 0.508: v25.93,11.48 26.01,11.48 26.54,10.95 26.54,9.13 USB1.GND
  Bottom 0.254: 41.33,49.71 42.01,49.71 42.17,49.57 | 40.54,49.71 40.54,51.16 | 8.74,50.42 8.36,50.42 8.19,50.5
  Bottom 0.61: v25.93,11.48 23.14,11.51 21.97,12.83 22,20.83 22,25.48 20.98,26.49 | 22,36.14 21.97,40.51 30.35,52.07 33.02,52.07
  Bottom 1.93: 8.74,51.26 10.31,51.26 10.31,51.23 10.29,51.23 10.29,49.68 8.61,49.68 8.61,49.71 8.74,49.71 8.74,50.42 8.74,51.13 | 39.75,51.16 40.54,51.16 41.33,51.16 | 39.75,49.71 40.54,49.71 41.33,49.71
  other vias: 36.2,50.8 24.54,36.7 22.35,31.24 22.02,23.09 6.88,54.56 30.15,47.83 5.92,53.54 22.12,56.34 14.12,22.3 34.37,11.15 31.42,29.54 41.76,67.51 5.28,34.21 25.27,31.24 18.26,14.53 14.3,39.07 45.82,58.65 31.5,2.49 23.14,12.04 9.37,22.76 12.09,34.47 25.86,6.55 20.42,5.77
  pour Bottom (isolate 0.305): 0,80 50,80 50,0 0,0
  pour Top (isolate 0.305): -0.38,79.87 50,80 50,0 -0.38,-0.13
IC2A-
  Top 0.254: 28.07,46.58 OPC.3 27.95,46.51 27.28,46.51 25.06,48.42 RN1.3 RN1.4 26.17,51.9 C21.1
IC2B-
  Top 0.254: OPC.5 24.29,50.27 RN1.2 RN1.1 21.38,52.1 C22.1
ISET-A
  Top 0.254: OPA-A.6 38.1,49.53 35.81,49.53 35.43,49.15 35.43,48.77 35.56,48.64 35.43,48.51 RIS-A.2
ISET-AB  (via drill 0.33)
  Top 0.254: v8.33,44.91 6.6,46.63 5.08,46.63 RIS-B.1 | IC1.7 23.88,28.14 23.98,28.25 v23.98,32.64 | v34.54,45.21 35.36,46.02 RIS-A.1 | v23.98,32.64 23.98,32.82 | v18.29,38.46 23.98,32.77 v23.98,32.64
  Bottom 0.254: v8.33,44.91 11.89,44.91 18.29,38.51 v18.29,38.46 | v23.98,32.64 23.98,34.65 v34.54,45.21
ISET-B
  Top 0.254: OPA-B.6 7.17,49.49 6.07,49.49 RIS-B.2
LDAC
  Top 0.254: IC1.13 18.8,25.6 18.69,25.5 16.2,25.5 15.44,24.74 15.44,22.43 15.42,22.4 15.42,22.12 14.73,21.44 13.01,21.44 12.95,21.38 DAC.8
MISO-AUX  (via drill 0.33)
  Top 0.254: v27.81,15.21 IC1.32 | v18.67,11.56 18.67,10.21 v18.75,10.13
  Bottom 0.254: v27.81,15.21 27.81,11.25 27.64,11.07 27.64,10.57 27.03,9.96 19.1,9.96 18.92,10.13 v18.75,10.13 | EXPANSION.10 14.51,15.72 v18.67,11.56
MOSI  (via drill 0.33)
  Top 0.254: IC1.17 18.83,22.32 18.69,22.45 18.54,22.3 v16.48,22.3 | v5.33,23.9 7.1,23.9 DAC.5
  Bottom 0.254: v16.48,22.3 15.27,22.3 13.66,23.9 v5.33,23.9
MOSI-AUX  (via drill 0.33)
  Top 0.254: v28.63,14.35 IC1.33
  Bottom 0.254: 11.58,15.65 EXPANSION.8 11.53,15.54 11.53,14.86 10.52,13.84 10.52,12.72 14.2,9.04 27.43,9.04 28.91,10.52 28.91,11.07 28.63,11.35 v28.63,14.35
PDI-CLK  (via drill 0.33)
  Top 0.254: v31.95,19.13 IC1.35
  Bottom 0.254: PROG.5 34.06,15.24 31.93,17.37 31.93,19.1 v31.95,19.13
PDI-DATA  (via drill 0.33)
  Top 0.254: IC1.34 33,18.32 v33.02,18.34
  Bottom 0.254: v33.02,18.34 35,20.32 PROG.1
PR1  (via drill 0.33)
  Top 0.254: IC1.37 33.48,20.72 35.03,19.18 35.03,17.98 v34.95,17.91
  Bottom 0.254: v34.95,17.91 44.37,17.91 PROG.3
SCK  (via drill 0.33)
  Top 0.254: 18.54,23.93 18.69,23.77 18.84,23.92 IC1.15 17.21,23.92 v16.82,23.52 | v5.33,25.17 7.1,25.17 DAC.4
  Bottom 0.254: v5.33,25.17 14.15,25.17 15.8,23.52 v16.82,23.52
SHDN-INS-A  (via drill 0.33)
  Top 0.254: v26.01,18.62 23.01,18.62 22.28,17.88 22.28,16.63 IC1.25 | CS-A.3 37.62,63.37 v38.33,62.66
  Bottom 0.254: v26.01,18.62 26.19,18.44 27.51,18.44 45.26,36.2 45.26,50.04 44.4,50.9 44.4,55.37 38.33,61.44 v38.33,62.66
SHDN-INS-B  (via drill 0.33)
  Top 0.254: CS-B.3 13.49,64.49 13.51,64.62 13.36,64.77 12.95,64.77 12.19,64.01 12.19,58.17 10.62,56.59 v4.98,56.59 | 18.8,19.2 IC1.21 v11.69,19.12 v11.68,19.13
  Bottom 0.254: v4.98,56.59 3.86,55.47 3.86,21.34 6.07,19.13 v11.68,19.13
SMU-A
  Top 0.254: CS-A.2 38.1,64.64 38.35,64.9 38.35,66.8 37.36,67.8 29.87,67.8 29,66.93 | 29,68.02 25.98,65 RN1.5 29.01,54.05 31.52,51.54 31.52,43.87 33.72,41.67 R5.1
  Top 0.406: CS-A.2
  Top 1.27: JP1.1 29,68.02 29,66.93 RS-A.2
  Bottom 0.254: JP1.1 26.95,74.95 20.12,74.95 13.82,68.66 6.27,68.66 2.31,64.69 2.31,17.4 EXPANSION.2
SMU-B  (via drill 0.33)
  Top 0.254: RN1.8 23.39,65.28 21,67.67 | CS-B.2 17.96,63.37 20.52,65.92 | 20.52,65.92 RS-B.2 | v16.48,66.02 20.42,66.02 20.52,65.92 | 21,72.85 21.34,72.85 JP1.4 | R6.1 4.38,39.51 v3.15,40.74
  Top 1.27: RS-B.2 21,67.67 21,72.85 21,73.1
  Bottom 0.254: 3.05,40.74 3.05,24.99 3.07,24.97 3.07,18.49 4.34,17.22 8.51,17.22 9.08,16.65 EXPANSION.6 | 3.05,40.74 3.05,64.26 4.8,66.02 v16.48,66.02 | 3.05,40.74 v3.15,40.74
SMUP-A
  Top 0.254: R5.2 35.9,41.65 SWA.1
SMUP-B
  Top 0.254: R6.2 5.65,38.55 SWB.1
SWMODE-A  (via drill 0.33)
  Top 0.254: 27.74,21.39 v27.71,21.41 27,20.7 23.27,20.7 20.62,18.05 IC1.23 | v38.18,43.84 40.09,43.84 SWA.6 | v37.54,40.41 37.59,40.41 v40.01,38
  Bottom 0.254: v27.71,21.41 27.76,21.41 40.08,33.73 40.08,37.92 v40.01,38 | v37.54,40.41 37.54,43.2 v38.18,43.84
SWMODE-B  (via drill 0.33)
  Top 0.254: v5.59,44.81 5.59,42.98 SWB.6 | v15.88,26.87 16.43,26.32 IC1.12
  Bottom 0.254: v5.59,44.81 5.56,44.78 5.56,37.19 10.52,32.23 10.85,31.9 v15.88,26.87
TFLAG-A
  Top 0.254: OPA-A.10 42.85,49.48 43.91,48.42 43.91,46.18 R4.1
TFLAG-B
  Top 0.254: 11.94,49.51 11.84,49.51 OPA-B.10 11.56,49.23 11.56,38.12 15,34.68 R3.2
TFLAGP-A  (via drill 0.33)
  Top 0.254: v27.46,19.84 23.22,19.84 21.49,18.11 21.49,16.64 IC1.24 | R4.2 45.66,45.86 v44.58,44.78
  Bottom 0.254: v44.58,44.78 44.58,36.96 v27.46,19.84
TFLAGP-B
  Top 0.254: IC1.11 20.62,29.64 18.19,32.08 17.5,32.08 16.75,32.08 R3.1
VIN-A
  Top 0.254: OPA-A.8 40.51,48.13 40.51,47.12 41.91,45.72 41.91,44.14
  Top 0.406: SWA.4 41.91,44.14
VIN-B
  Top 0.254: 7.75,43.06 9.4,44.7 9.4,48.07
  Top 0.406: SWB.4 7.75,43.06 | 9.4,48.07 OPA-B.8
VO-A
  Top 0.254: 35.92,65.91 32.38,65.91 29.45,62.98 29.02,62.98 | CS-A.1 35.13,65.91 | C10.2 43.3,58.24 39.65,58.24 38.57,57.16 38.57,54.43 | 39.87,52.97 39.62,52.97 OPA-A.3 | 28.96,63.04 28.96,63.56
  Top 0.406: 35.92,65.91 CS-A.1 | OPA-A.3 39.51,52.83 40.49,52.83 OPA-A.2
  Top 0.61: 28.96,63.56 RS-A.1 | 28.96,63.04 29.02,62.98
  Top 1.016: 39.87,52.97 39.87,53.13 38.57,54.43 38.49,54.51 31.62,54.51 28.96,57.17 28.96,63.04
VO-B
  Top 0.254: 18.24,62.09 18.24,62.38 | C11.2 13.11,59.23 14.22,59.23
  Top 0.61: OPA-B.2 OPA-B.3
  Top 1.016: RS-B.1 19.5,62.09 18.24,62.09 CS-B.1 14.22,61.94 14.22,59.23 14.22,58.19 9.47,53.44 OPA-B.2
VOUT-A  (via drill 0.33)
  Top 0.254: v42.37,47.35 41.55,48.16 OPA-A.9 | DAC.14 13.06,29.74 v19.3,29.74
  Bottom 0.254: v42.37,47.35 42.37,42.77 29.34,29.74 v19.3,29.74
VOUT-B
  Top 0.254: 10.46,48.28 OPA-B.9 10.49,48.19 10.49,35.2 9.17,33.88 9.17,24.03 9.28,23.92 DAC.10 12.3,23.9
VS-A  (via drill 0.33)
  Top 0.254: 45.72,62.48 R2.1 43.43,62.48 42.71,61.76 | CS-A.5 42.38,62.09 42.71,61.76 | v43.41,61.06 42.71,61.76 | IC1.41 35.2,23.92 v36.17,24.89
  Bottom 0.254: v43.41,61.06 43.41,58.62 47.17,54.86 47.17,35.89 v36.17,24.89 35.92,24.64
VS-B  (via drill 0.33)
  Top 0.254: CS-B.5 7.92,65.84 | IC1.3 27.02,31.22 13.82,44.42 v13.82,46.15 | R1.1 9.96,69.19 9.96,67.97 7.92,65.94 CS-B.5 | v5.54,64.9 6.54,65.91 CS-B.5
  Bottom 0.254: v13.82,46.15 13.51,46.46 7.16,46.46 5,48.62 5,54.1 8.23,57.33 8.23,63.91 7.24,64.9 v5.54,64.9

### Text on the board
tPlace: EXT | GND | USB
tNames: B | GND | A | OPB | OPA | DATA | 3.3V | chA | 3v3 | chB | E3 | E2 | BOOT | EXPANSION | GND | 5v | AUX | E1 | E0 | CLK | GND | 1.0 RC1 | Nonolith Labs